# EAGLE design tiny85 (EAGLE 7.4.0)
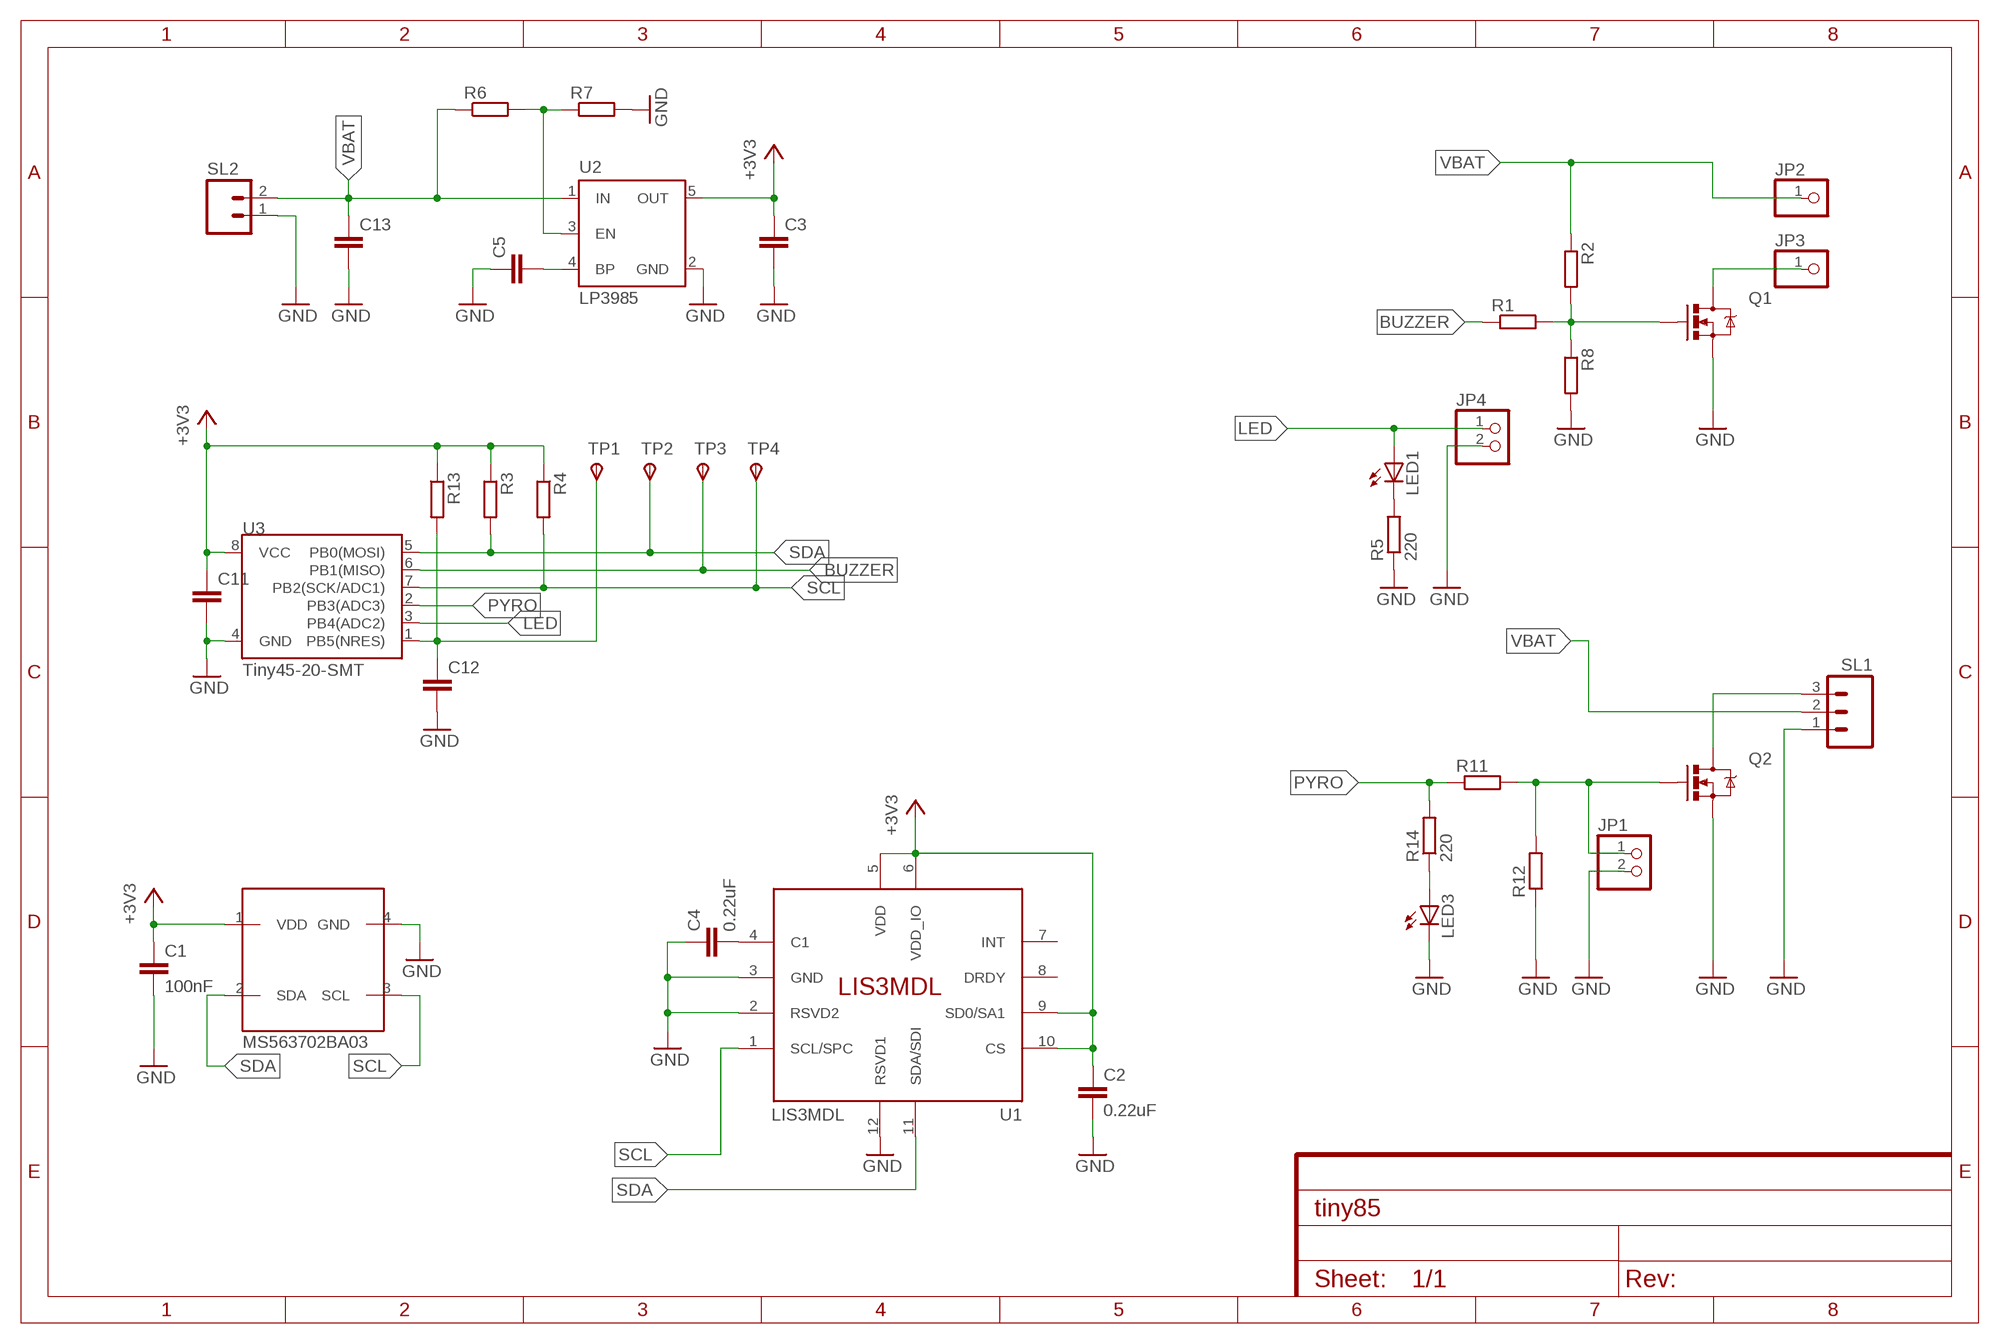
[diagram p0: schematic, sheet 1]

## Parts
C1  100nF  C-EUC0603  [C0603]
C2  0.22uF  C-EUC0603K  [C0603K]
C3  C-EUC0603  [C0603]
C4  0.22uF  C-EUC0603K  [C0603K]
C5  C-EUC0603  [C0603]
C11  C-EUC0603  [C0603]
C12  C-EUC0603  [C0603]
C13  C-EUC0603  [C0603]
IC1  MS563702BA03  [MS5637]
JP1  PINHD-1X2  [1X02]
JP2  PINHD-1X1  [1X01]
JP3  PINHD-1X1  [1X01]
JP4  PINHD-1X2  [1X02]
LED1  LEDCHIPLED_0805  [CHIPLED_0805]
LED3  LEDCHIPLED_0805  [CHIPLED_0805]
Q1  MOSFET-NCHANNELBSS123LT1G  [SOT23-3]
Q2  MOSFET-NCHANNELBSS123LT1G  [SOT23-3]
R1  R-EU_R0603  [R0603]
R2  R-EU_R0603  [R0603]
R3  R-EU_R0603  [R0603]
R4  R-EU_R0603  [R0603]
R5  220  R-EU_R0603  [R0603]
R6  R-EU_R0603  [R0603]
R7  R-EU_R0603  [R0603]
R8  R-EU_R0603  [R0603]
R11  R-EU_R0603  [R0603]
R12  R-EU_R0603  [R0603]
R13  R-EU_R0603  [R0603]
R14  220  R-EU_R0603  [R0603]
SL1  M03  [03P]
SL2  M02  [02P]
TP1  TPSB1,27  [B1,27]
TP2  TPSB1,27  [B1,27]
TP3  TPSB1,27  [B1,27]
TP4  TPSB1,27  [B1,27]
U1  LIS3MDL  [VFLGA-12]
U2  LP3985  VREG-5PIN-SOT23  [SOT23-5]
U3  Tiny45-20-SMT  ATTINY45TINY45-20-SMT  [SO08-EIAJ]

## Nets
+3V3: C1.1 C2.1 C3.1 C11.1 IC1.1(VDD) R3.1 R4.1 R13.1 U1.5(VDD) U1.6(VDD_IO) U1.9(SD0/SA1) U1.10(CS) U2.5(OUT) U3.8(VCC)
BUZZER: R1.1 TP3.TP(PP) U3.6(PB1(MISO))
GND: C1.2 C2.2 C3.2 C4.1 C5.1 C11.2 C12.2 C13.2 IC1.4(GND) JP1.2 JP4.2 LED3.C Q1.2(S) Q2.2(S) R5.1 R7.2 R8.2 R12.1 SL1.1 SL2.1 U1.2(RSVD2) U1.3(GND) U1.12(RSVD1) U2.2(GND) U3.4(GND)
LED: JP4.1 LED1.A U3.3(PB4(ADC2))
N$1: JP3.1 Q1.3(D)
N$2: C5.2 U2.4(BP)
N$3: Q1.1(G) R1.2 R2.2 R8.1
N$4: LED1.C R5.2
N$5: C4.2 U1.4(C1)
N$6: R6.2 R7.1 U2.3(EN)
N$14: Q2.3(D) SL1.3
N$15: C12.1 R13.2 TP1.TP(PP) U3.1(PB5(NRES))
N$19: JP1.1 Q2.1(G) R11.2 R12.2
N$23: LED3.A R14.1
PYRO: R11.1 R14.2 U3.2(PB3(ADC3))
SCL: IC1.3(SCL) R4.2 TP4.TP(PP) U1.1(SCL/SPC) U3.7(PB2(SCK/ADC1))
SDA: IC1.2(SDA) R3.2 TP2.TP(PP) U1.11(SDA/SDI) U3.5(PB0(MOSI))
VBAT: C13.1 JP2.1 R2.1 R6.1 SL1.2 SL2.2 U2.1(IN)
Unconnected: U1.7(INT) U1.8(DRDY)

## Library data of the parts
C1-C5 C11-C13 = rcl:C-EU: CAPACITOR, European symbol
IC1 = freetronics-original:MS5637
JP1 JP4 = pinhead:PINHD-1X2: PIN HEADER
JP2 JP3 = pinhead:PINHD-1X1: PIN HEADER
LED1 LED3 = led:LED: LED OSRAM: - CHIPLED LG R971, LG N971, LY N971, LG Q971, LY Q971, LO R971, LY R971 LH N974, LH R974 LS Q976, LO Q976, LY Q976 LO Q996 - Hyper CHIPLED LW Q18S LB Q993, LB Q99A, LB R99A - SideLED LS A670, LO A670, LY A670, LG A670, LP A670 LB A673, LV A673, LT A673, LW A673 LH A674 LY A675 LS A676, LA A676, LO A676, LY A676, LW A676 LS A679, LY A679, LG A679 - Hyper Micro SIDELED® LS Y876, LA Y876, LO Y876, LY Y876 LT Y87S - SmartLED LW L88C, LW L88S LB L89C, LB L89S, LG L890 LS L89K, LO L89K, LY L89K LS L896, LA L896, LO L896, LY L896 - TOPLED LS T670, LO T670, LY T670, LG T670, LP T670 LSG T670, LSP T670, LSY T670, LOP T670, LYG T670 LG T671, LOG T671, LSG T671 LB T673, LV T673, LT T673, LW T673 LH T674 LS T676, LA T676, LO T676, LY T676, LB T676, LH T676, LSB T676, LW T676 LB T67C, LV T67C, LT T67C, LS T67K, LO T67K, LY T67K, LW E67C LS E67B, LA E67B, LO E67B, LY E67B, LB E67C, LV E67C, LT E67C LW T67C LS T679, LY T679, LG T679 LS T770, LO T770, LY T770, LG T770, LP T770 LB T773, LV T773, LT T773, LW T773 LH T774 LS E675, LA E675, LY E675, LS T675 LS T776, LA T776, LO T776, LY T776, LB T776 LHGB T686 LT T68C, LB T68C - Hyper Mini TOPLED® LB M676 - Mini TOPLED Santana® LG M470 LS M47K, LO M47K, LY M47K Source: http://www.osram.convergy.de LUXEON: - LUMILED® LXK2-PW12-R00, LXK2-PW12-S00, LXK2-PW14-U00, LXK2-PW14-V00 LXK2-PM12-R00, LXK2-PM12-S00, LXK2-PM14-U00 LXK2-PE12-Q00, LXK2-PE12-R00, LXK2-PE12-S00, LXK2-PE14-T00, LXK2-PE14-U00 LXK2-PB12-K00, LXK2-PB12-L00, LXK2-PB12-M00, LXK2-PB14-N00, LXK2-PB14-P00, LXK2-PB14-Q00 LXK2-PR12-L00, LXK2-PR12-M00, LXK2-PR14-Q00, LXK2-PR14-R00 LXK2-PD12-Q00, LXK2-PD12-R00, LXK2-PD12-S00 LXK2-PH12-R00, LXK2-PH12-S00 LXK2-PL12-P00, LXK2-PL12-Q00, LXK2-PL12-R00 Source: www.luxeon.com KINGBRIGHT: KA-3528ASYC Source: www.kingbright.com
Q1 Q2 = SparkFun-DiscreteSemi:MOSFET-NCHANNEL: Common NMOSFET Parts MFG P/N Store ID Prod ID FDD8780 TRANS-09984 SI7820DN TRANS-11055 FDS6630A IC-08089 2N7002PW TRANS-11151 FQP30N06L COM-10213 TRANS-10060 BSS123LT1G TRANS-08345 BSS138 TRANS-00830 BS170 2N7000; PROD_ID: TRANS-08345
R1-R4 R6-R8 R11-R13 = rcl:R-EU_: RESISTOR, European symbol
R5 R14 = resistor:R-EU_: RESISTOR, European symbol
SL1 = con-amp-quick:M03: AMP QUICK CONNECTOR; OC_FARNELL: unknown; OC_NEWARK: unknown
SL2 = con-amp-quick:M02: AMP QUICK CONNECTOR; OC_FARNELL: unknown; OC_NEWARK: unknown
TP1-TP4 = testpad:TPS: TEST PIN
U1 = kg-ic:LIS3MDL: Digital output magnetic sensor: ultra-low-power high-performance 3-axis magnetometer The LIS3MDL is an ultra-low-power high-performance three-axis Magnetic Sensor. It has user-selectable full scales of ±4/ ±8/ ±12/ ±16 gauss. The self-test capability allows the user to check the functioning of the sensor in the final application. The device may be configured to generate interrupt signals for magnetic field detection. It includes an I²C serial bus interface that supports standard and fast mode (100 and 400kHz) and SPI serial standard interface. Independent IO Supply (1.8V) ±4/±8/±12/±16 Gauss Selectable Magnetic Full Scale Continuous and Single-conversion Modes 16-bit Data Output Interrupt Generator Self-test I²C/SPI Digital Output Interface Power-down Mode/Low-power Mode
U2 = kg-generic:VREG-5PIN: Linear voltage regulator with enable pin
U3 = SparkFun-DigitalIC:ATTINY45: Atmel 8-pin 2/4/8kB flash uC; PROD_ID: IC-08922

## Board
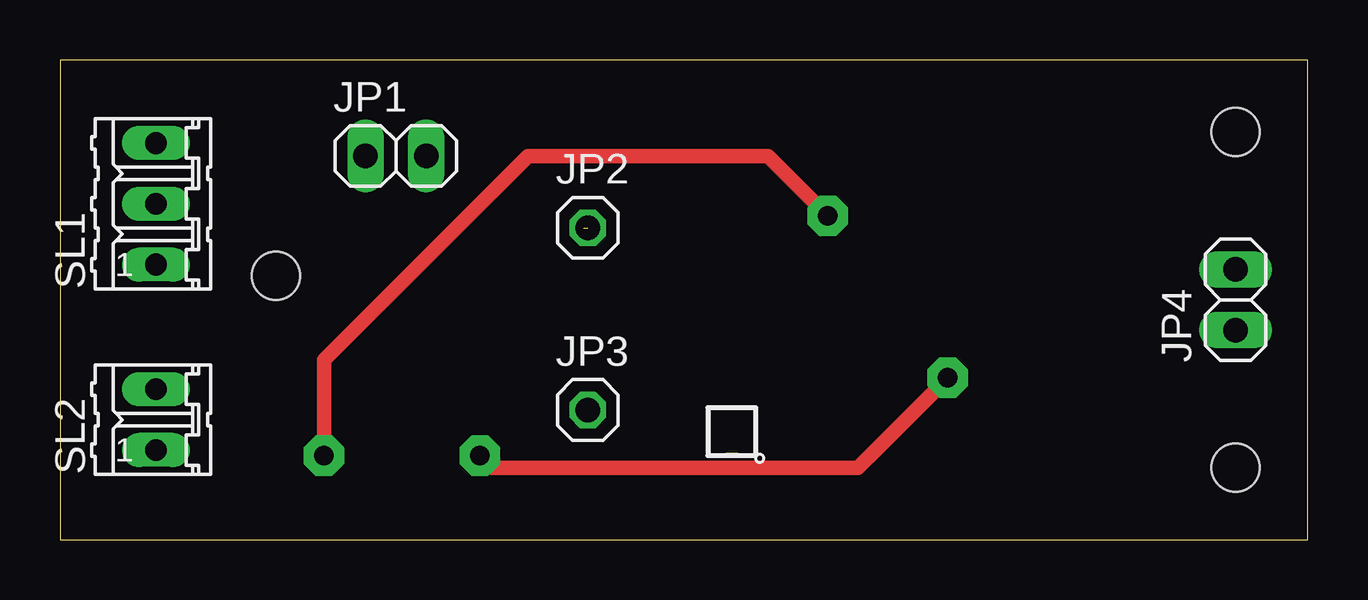
[diagram p1: board, top side]
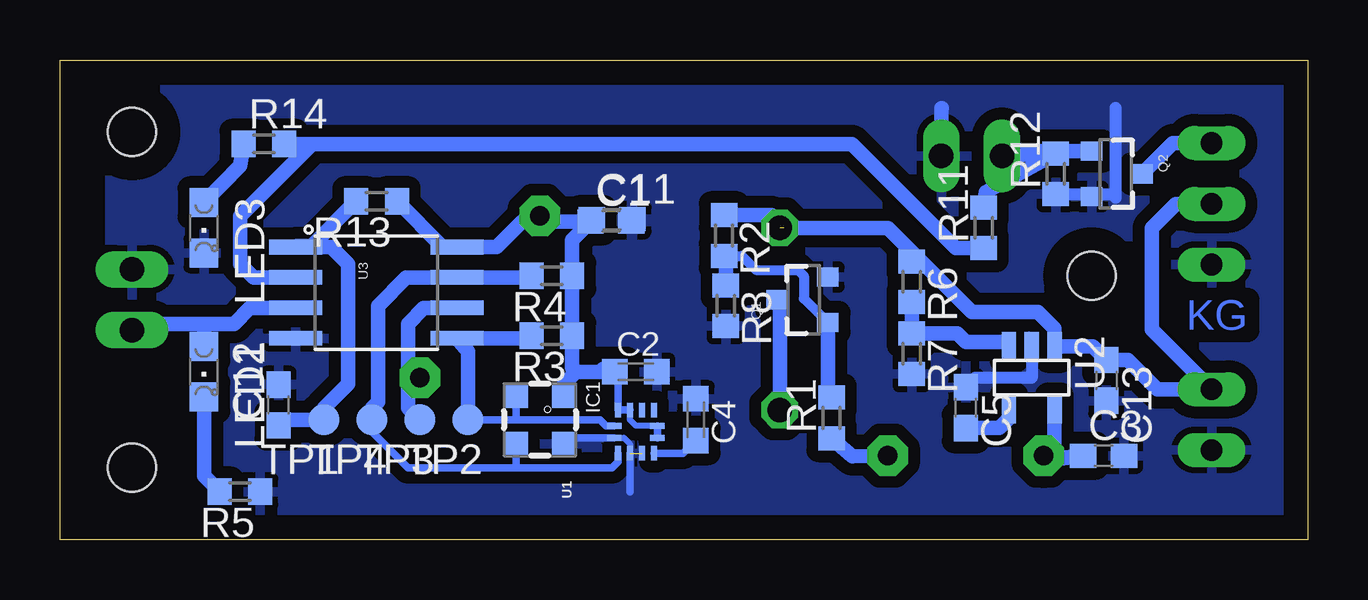
[diagram p2: board, bottom side, seen from below]

Size 52 x 20 mm. Coordinates in mm from the lower left corner, seen from the top.
Outline: 0,0 52,0 52,20 0,20 0,0
Copper layers (1*16): Top 0.035mm / dielectric 1.5mm / Bottom 0.035mm
Design rules "default": minimum track width 10mil, minimum drill 24mil, track to track 8mil, track to pad 8mil, pad to pad 8mil, via to via 8mil, smd to smd 8mil, copper to edge 40mil, drill to drill 8mil, minimum pad ring 10mil, minimum via ring 8mil, stop-mask expansion 4mil, vias tented up to drill 0mil, thermal gap 10mil
Holes 2 mm at 49,17 49,3 9,11

### Footprints (pad centres in the part's own frame; a part is rotated, then mirrored left to right if it is on the bottom)
C0603 = smd 1.1 x 1: 1 -0.85,0; 2 0.85,0
C0603K = smd 1.05 x 1.08: 1 -0.875,0; 2 0.875,0
MS5637 = smd 1 x 1: 1 -1,1; 2 -1,-1; 3 1,-1; 4 1,1
1X02 = drill 1.016 long: 1 -1.27,0; 2 1.27,0
1X01 = drill 1.016 octagon: 1 0,0
CHIPLED_0805 = smd 1.2 x 1.2: A 0,-1.05; C 0,1.05
SOT23-3 = smd 0.8 x 0.9: 1 -0.95,-1; 2 0.95,-1; 3 0,1.1
R0603 = smd 1 x 1.1: 1 -0.85,0; 2 0.85,0
03P = drill 0.914 long: 1 -2.54,0; 2 0,0; 3 2.54,0
02P = drill 0.914 long: 1 -1.27,0; 2 1.27,0
B1,27 = smd 1.27 x 1.27: TP 0,0
VFLGA-12 = smd 0.6 x 0.25: 1 -0.9,0.75; 2 -0.9,0.25; 3 -0.9,-0.25; 4 -0.9,-0.75; 7 0.9,-0.75; 8 0.9,-0.25; 9 0.9,0.25; 10 0.9,0.75 | smd 0.25 x 0.6: 5 -0.25,-0.9; 6 0.25,-0.9; 11 0.25,0.9; 12 -0.25,0.9
SOT23-5 = smd 0.6 x 1.2: 1 -0.95,-1.306; 2 0,-1.306; 3 0.95,-1.306; 4 0.95,1.306; 5 -0.95,1.306
SO08-EIAJ = smd 0.61 x 2.21: 1 -1.905,-3.378; 2 -0.635,-3.378; 3 0.635,-3.378; 4 1.905,-3.378; 5 1.905,3.353; 6 0.635,3.353; 7 -0.635,3.353; 8 -1.905,3.353

### Placement (x,y rotation side)
C1  29.04,13.27 0 bottom
C2  28,7 0 bottom
C3  8.5,3.5 0 bottom
C4  25.5,5 270 bottom
C5  14.25,5.5 270 bottom
C11  28.99,13.36 0 bottom
C12  42.9,5.61 90 bottom
C13  8.39,6.64 270 bottom
IC1  32,5 270 bottom
JP1  14,16 0 top
JP2  22,13 0 top
JP3  22,5.4 0 top
JP4  49,10 90 top
LED1  46,7 180 bottom
LED3  46,13 180 bottom
Q1  21,10 90 bottom
Q2  8,15.25 270 bottom
R1  19.84,5.07 90 bottom
R2  24.32,12.68 270 bottom
R3  31.5,8.5 180 bottom
R4  31.5,11 180 bottom
R5  44.5,2 180 bottom
R6  16.5,10.75 270 bottom
R7  16.5,7.75 270 bottom
R8  24.25,9.75 270 bottom
R11  13.5,13 90 bottom
R12  10.5,15.25 90 bottom
R13  38.8,14.11 180 bottom
R14  43.5,16.5 0 bottom
SL1  4,14 90 top
SL2  4,5 90 top
TP1  41,5 180 bottom
TP2  35,5 180 bottom
TP3  37,5 180 bottom
TP4  39,5 180 bottom
U1  28,4.5 90 bottom
U2  11.5,6.75 180 bottom
U3  38.8,10.29 270 bottom

### Tracks (layer width: path | path; a pad name or v marks a point on that pad's centre or on a via)
+3V3  (via drill 0.8 pad 1.68)
  Top 0.61: v11,3.5 11,7.5 19.5,16 29.5,16 v32,13.5
  Bottom 0.254: U1.6 28,4.75 28.25,5 U1.9
  Bottom 0.305: U1.9 U1.10 28.75,6.88 C2.1 | U1.5 U1.6
  Bottom 0.61: C1.1 32.27,13.27 | 32.27,13.27 v32,13.5 | U2.5 10.55,3.4 C3.1 10.5,3.35 10.65,3.35 11,2.95 v11,3.5 | 32.27,13.27 32.73,13.27 33.8,12.2 U3.8 36.05,12.2 R13.1 | C2.1 29,7.12 29.38,7.12 29.5,7 30.5,7 | C1.1 30.65,12.5 R4.1 R3.1 30.65,7.15 30.5,7 | C1.1 29.89,13.31 C11.1 | IC1.1 31,6.5 30.5,7
BUZZER  (via drill 0.8 pad 1.68)
  Top 0.61: v17.5,3.5 18,3 33.25,3 v37,6.75
  Bottom 0.61: U3.6 36.84,9.66 37.5,9 37.5,7 | 37.5,7 37.5,5.5 TP3.TP | v37,6.75 37.25,6.75 37.5,7 | R1.1 18.97,3.47 v17.5,3.5
GND  (1 unrouted)
  Bottom 0.254: U1.12 28.5,4.25 28.25,4 U1.2
  Bottom 0.305: U1.2 28.25,2 | U1.12 30.75,4.25 IC1.4
  Bottom 0.5: R12.1 8.15,14.4 8,14.25 8,18 | U2.2 11.5,6.75 13.85,6.75 C5.1
  Bottom 0.61: JP1.2 15.27,17.98 15.25,18
  pour Bottom (isolate 0.5): 0,20.29 49.93,20.29 49.93,0.27 0,0.27
LED
  Bottom 0.61: U3.3 44.09,9.66 44.75,9 46,9 | 48.68,9.05 JP4.1 49,9 46,9 | LED1.A 46,9
N$1
  Bottom 0.61: Q1.3 22,10 JP3.1
N$2
  Bottom 0.61: C5.2 12.85,4.65 12.45,5.05 U2.4
N$3
  Bottom 0.406: R2.2 23.58,11.83 23,11.25 21.25,11.25 21,11 21,10.05 Q1.1
  Bottom 0.61: R1.2 19.92,5.92 20,6 Q1.1 | R8.1 24.25,11.77 R2.2
N$4
  Bottom 0.61: LED1.C 46,2.65 R5.2
N$5
  Bottom 0.305: U1.4 26.02,3.6 C4.2
N$6
  Bottom 0.61: R6.2 R7.1 14.6,8.6 14.25,8.25 12.64,8.25 U2.3
N$14
  Bottom 0.61: SL1.3 5.61,16.54 Q2.3
N$15
  Bottom 0.61: 41.5,12.25 42.13,12.25 U3.1 | U3.1 40.7,12.2 40,11.5 40,6.5 41,5.5 TP1.TP 42.66,5 C12.1 | R13.2 41.55,12.2 U3.1
N$19
  Bottom 0.61: Q2.1 11.53,16.2 JP1.1 12.33,16.02 R12.2 13.4,14.5 R11.2
N$23
  Bottom 0.61: LED3.A 44.5,15.6 R14.1
PYRO
  Bottom 0.61: 41.5,16.5 44.5,13.5 44.5,11.5 43.93,10.93 U3.2 | 41.5,16.5 19,16.5 14.65,12.15 R11.1 13.35,12 | 41.5,16.5 R14.2
SCL
  Bottom 0.305: 33,3 29,3 28.75,3.25 U1.1 | 33,3 37.5,3 39,4.5 TP4.TP | IC1.3 33,3
  Bottom 0.61: TP4.TP 39,5.5 38.75,5.75 38.75,9.75 37.57,10.93 U3.7 32.42,10.93 R4.2
SDA
  Bottom 0.305: U1.11 29.25,4.75 29.5,5 33,5 | 33,5 TP2.TP | IC1.2 33,5
  Bottom 0.61: TP2.TP 35,7.84 U3.5 32.46,8.39 R3.2
VBAT  (1 unrouted)
  Bottom 0.61: 16.25,11.75 14,9.5 11.25,9.5 10.55,8.8 U2.1 8.96,8.06 C13.1 7.49,7.49 6.27,6.27 SL2.2 6.5,8.77 6.5,13 5.5,14 SL1.2 | 16.25,11.75 17.5,13 21.82,13 22.34,13.53 R2.1 | R6.1 16.15,11.6 16.25,11.75

### Text on the board
Bottom: KG